# EAGLE design lm3410-sepic-rgb-led-driver-tester-mk-1 (EAGLE 6.4)
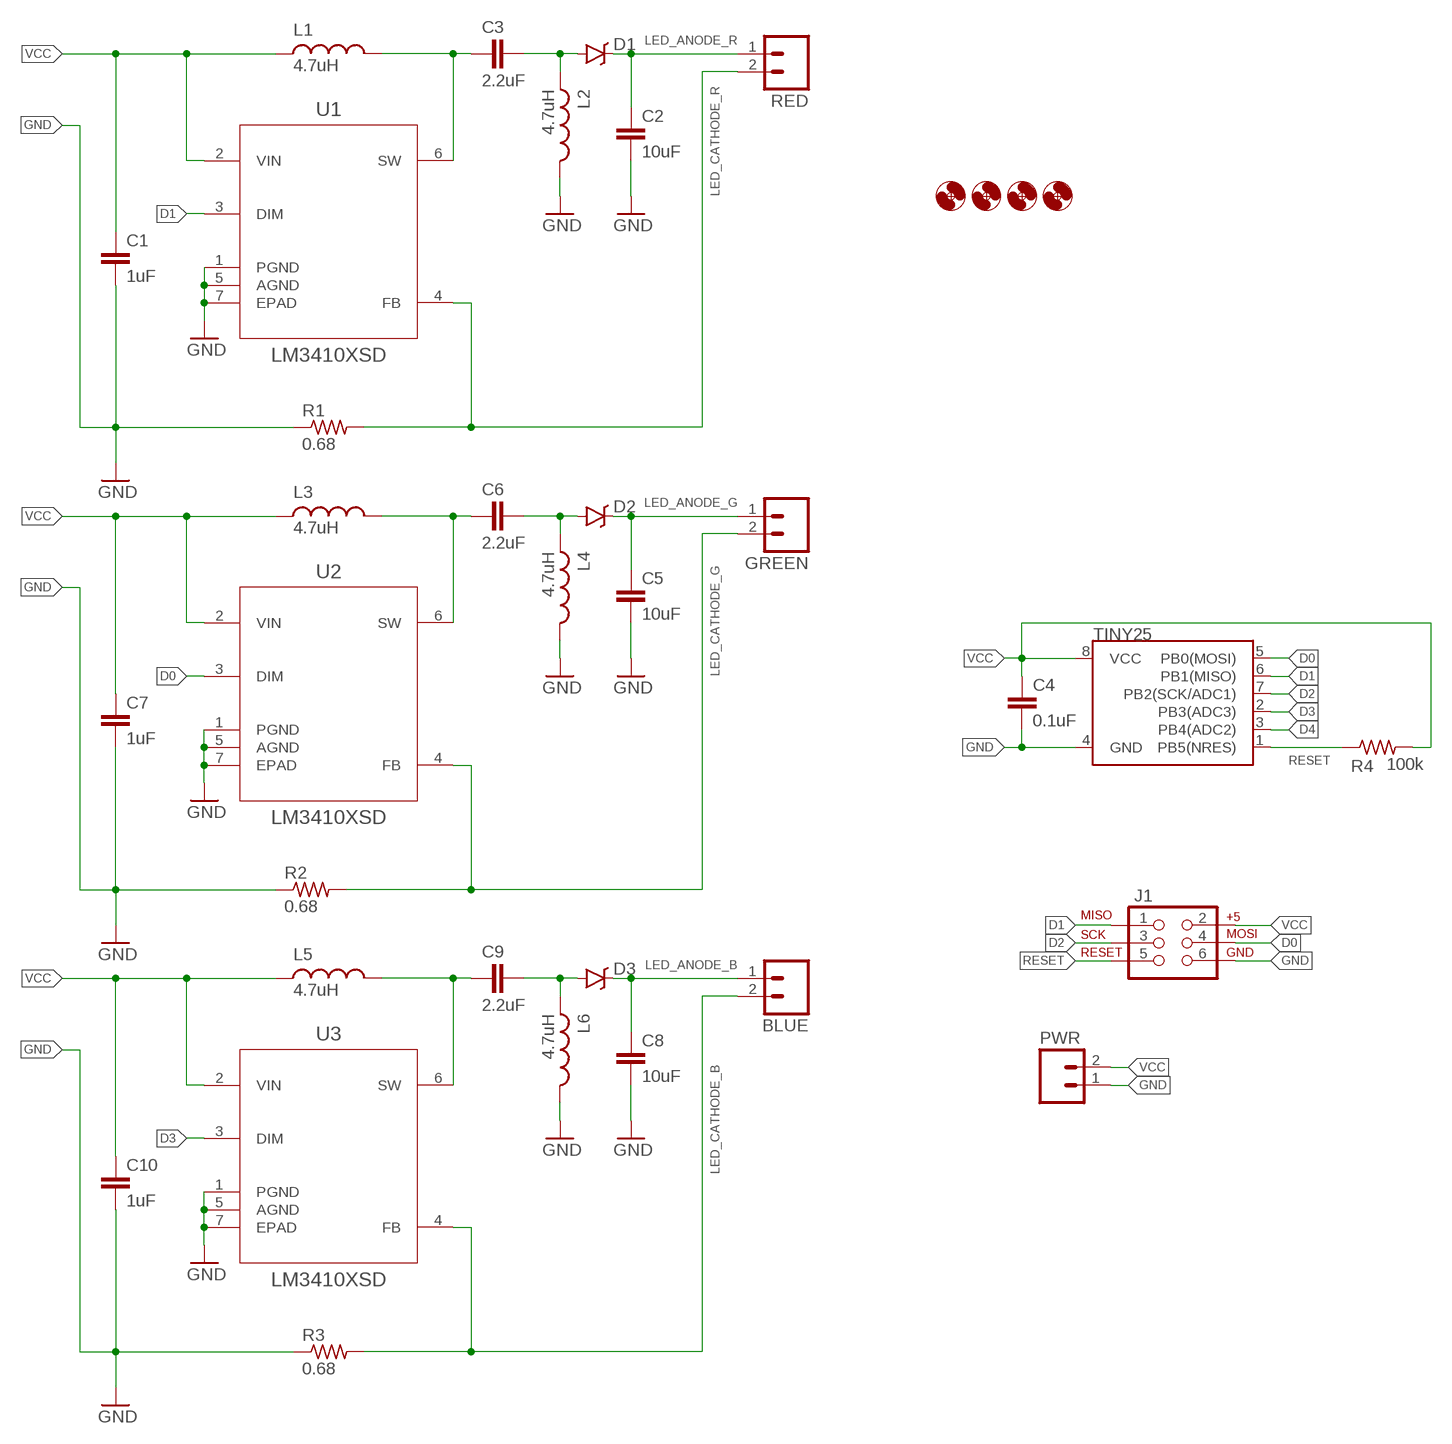
[diagram p0: schematic, sheet 1]

## Parts
BLUE  M02JST-PTH-VERT  [JST-2-PH-VERT-PTH]
C1  1uF  CAPACITOR-CERAMICC0603  [C0603]
C2  10uF  CAPACITOR-CERAMICC0603  [C0603]
C3  2.2uF  CAPACITOR-CERAMICC0805  [C0805]
C4  0.1uF  CAPACITOR-CERAMICC0603  [C0603]
C5  10uF  CAPACITOR-CERAMICC0603  [C0603]
C6  2.2uF  CAPACITOR-CERAMICC0805  [C0805]
C7  1uF  CAPACITOR-CERAMICC0603  [C0603]
C8  10uF  CAPACITOR-CERAMICC0603  [C0603]
C9  2.2uF  CAPACITOR-CERAMICC0805  [C0805]
C10  1uF  CAPACITOR-CERAMICC0603  [C0603]
D1  PMEG4005EJ  DIODE-SCHOTTKY-PMEG4005EJ  [SOD-323]
D2  PMEG4005EJ  DIODE-SCHOTTKY-PMEG4005EJ  [SOD-323]
D3  PMEG4005EJ  DIODE-SCHOTTKY-PMEG4005EJ  [SOD-323]
GREEN  M02JST-PTH-VERT  [JST-2-PH-VERT-PTH]
H1  HOLE#2  [HOLE-#2]
H2  HOLE#2  [HOLE-#2]
H3  HOLE#2  [HOLE-#2]
H4  HOLE#2  [HOLE-#2]
J1  AVR_SPI_PRG_6PTH  [2X3]
L1  4.7uH  INDUCTORIFSC-0806  [INDUCTOR_2X1.6MM]
L2  4.7uH  INDUCTORIFSC-0806  [INDUCTOR_2X1.6MM]
L3  4.7uH  INDUCTORIFSC-0806  [INDUCTOR_2X1.6MM]
L4  4.7uH  INDUCTORIFSC-0806  [INDUCTOR_2X1.6MM]
L5  4.7uH  INDUCTORIFSC-0806  [INDUCTOR_2X1.6MM]
L6  4.7uH  INDUCTORIFSC-0806  [INDUCTOR_2X1.6MM]
PWR  M02JST-PTH-VERT  [JST-2-PH-VERT-PTH]
R1  0.68  RESISTORR0805  [R0805]
R2  0.68  RESISTORR0805  [R0805]
R3  0.68  RESISTORR0805  [R0805]
R4  100k  RESISTORR0603  [R0603]
RED  M02JST-PTH-VERT  [JST-2-PH-VERT-PTH]
TINY25  ATTINY45TINY25-20-SOICN  [SO08]
U1  LM3410XSD  [DFN300X300X80-7N]
U2  LM3410XSD  [DFN300X300X80-7N]
U3  LM3410XSD  [DFN300X300X80-7N]

## Nets
D0: J1.4 TINY25.5(PB0(MOSI)) U2.3(DIM)
D1: J1.1 TINY25.6(PB1(MISO)) U1.3(DIM)
D2: J1.3 TINY25.7(PB2(SCK/ADC1))
D3: TINY25.2(PB3(ADC3)) U3.3(DIM)
D4: TINY25.3(PB4(ADC2))
GND: C1.2 C2.2 C4.2 C5.2 C7.2 C8.2 C10.2 J1.6 L2.P$2 L4.P$2 L6.P$2 PWR.1 R1.1 R2.1 R3.1 TINY25.4(GND) U1.1(PGND) U1.5(AGND) U1.7(EPAD) U2.1(PGND) U2.5(AGND) U2.7(EPAD) U3.1(PGND) U3.5(AGND) U3.7(EPAD)
LED_ANODE_B: BLUE.1 C8.1 D3.C
LED_ANODE_G: C5.1 D2.C GREEN.1
LED_ANODE_R: C2.1 D1.C RED.1
LED_CATHODE_B: BLUE.2 R3.2 U3.4(FB)
LED_CATHODE_G: GREEN.2 R2.2 U2.4(FB)
LED_CATHODE_R: R1.2 RED.2 U1.4(FB)
N$1: C3.2 D1.A L2.P$1
N$2: C6.2 D2.A L4.P$1
N$5: C9.2 D3.A L6.P$1
RESET: J1.5 R4.1 TINY25.1(PB5(NRES))
SW: C3.1 L1.P$2 U1.6(SW)
SW1: C6.1 L3.P$2 U2.6(SW)
SW2: C9.1 L5.P$2 U3.6(SW)
VCC: C1.1 C4.1 C7.1 C10.1 J1.2 L1.P$1 L3.P$1 L5.P$1 PWR.2 R4.2 TINY25.8(VCC) U1.2(VIN) U2.2(VIN) U3.2(VIN)

## Library data of the parts
BLUE GREEN PWR RED = A_butts:M02: Standard 2-pin 0.1" header. Use with - straight break away headers ( PRT-00116) - right angle break away headers (PRT-00553) - swiss pins (PRT-00743) - machine pins (PRT-00117) - female headers (PRT-00115) Molex polarized connector foot print use with: PRT-08233 with associated crimp pins and housings. 2.54_SCREWTERM for use with PRT-10571. 3.5mm Screw Terminal footprints for PRT-08084 5mm Screw Terminal footprints for use with PRT-08433
C1-C10 = A_butts:CAPACITOR-CERAMIC: CAPACITOR, European symbol
D1-D3 = A_butts:DIODE-SCHOTTKY: Schottky diodes in SFE's production catalog BAT20J 1A 23V 0.62Vf RB751 120mA 40V 0.37Vf PMEG4005EJ 0.5A 40V 0.42Vf MBRA140 1A 40V 0.5Vf B340A 3A 40V SMA; PROD_ID: DIO-10955
H1-H4 = A_butts:HOLE: MOUNTING HOLE with drill center marker
J1 = A_butts:AVR_SPI_PRG_6: AVR ISP 6 Pin This is the reduced ISP connector for AVR programming. Common on Arduino. This footprint will take up less PCB space and can be used with a 10-pin to 6-pin adapter such as SKU: BOB-08508 **Special note about "TEST_POINT" package. The stop mask is on the top side, so if you want your programming test points to be on the bottom of your board, make sure to place this package on the bottom side of the board. This also ensure that the orientation to program from the bottom side will be correct.
L1-L6 = A_butts:INDUCTOR: Inductors Basic Inductor/Choke - 0603 and 1206. Footprints are not proven and vary greatly between part numbers. SRN6045- 33uH, 20% 1.4A SDR0403-560KL - 56uH, 10%, 500mA RMS/740mA peak
R1-R4 = A_butts:RESISTOR: RESISTOR, American symbol
TINY25 = A_butts:ATTINY45: Atmel 8-pin 2/4/8kB flash uC
U1-U3 = A_butts:LM3410XSD: Constant Current Boost and SEPIC LED Driver; MPN: LM3410XSD; OC_FARNELL: -; OC_NEWARK: 11N9218; PACKAGE: DFN-6; SUPPLIER: National Semiconductor

## Board
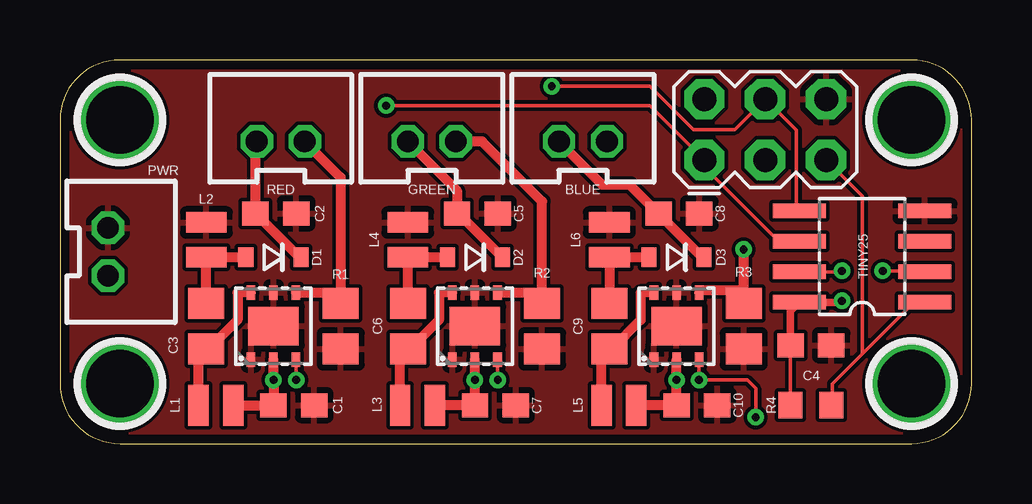
[diagram p1: board, top side]
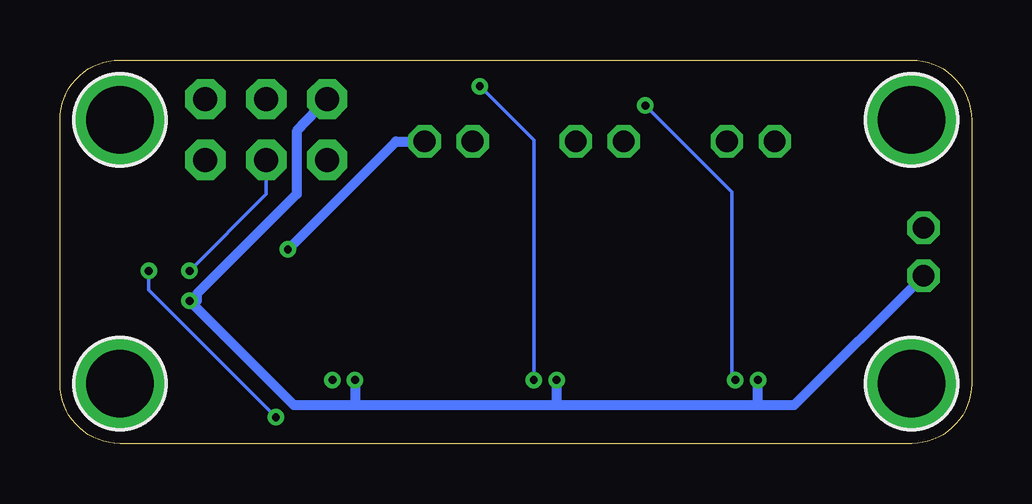
[diagram p2: board, bottom side, seen from below]

Size 38 x 16 mm. Coordinates in mm from the lower left corner, seen from the top.
Outline: 2.5,0 35.5,0 arc90 38,2.5 38,13.5 arc90 35.5,16 2.5,16 arc90 0,13.5 0,2.5 arc90 2.5,0
Copper layers (1*16): Top 0.0356mm / dielectric 1.5011mm / Bottom 0.0356mm
Design rules "LaenPCBOrder2": minimum track width 6mil, minimum drill 13mil, track to track 6mil, track to pad 6mil, pad to pad 6mil, via to via 6mil, smd to smd 6mil, copper to edge 15mil, drill to drill 6mil, minimum pad ring 7mil, minimum via ring 7mil, stop-mask expansion 3mil, vias tented up to drill 20mil, thermal gap 10mil

### Footprints (pad centres in the part's own frame; a part is rotated, then mirrored left to right if it is on the bottom)
JST-2-PH-VERT-PTH = drill 0.9 octagon: 1 -1,0; 2 1,0
C0603 = smd 1.1 x 1: 1 -0.85,0; 2 0.85,0
C0805 = smd 1.3 x 1.5: 1 -0.95,0; 2 0.95,0
SOD-323 = smd 0.63 x 0.83: A 1.15,0; C -1.15,0
HOLE-#2 = drill 2.8 pad 3.81: P$1 0,0
2X3 = drill 1 pad 1.676 octagon: 1 -2.54,-1.27; 2 -2.54,1.27; 3 0,-1.27; 4 0,1.27; 5 2.54,-1.27; 6 2.54,1.27
INDUCTOR_2X1.6MM = smd 0.85 x 1.7: P$1 -0.725,0; P$2 0.725,0
R0805 = smd 1.3 x 1.5: 1 -0.95,0; 2 0.95,0
R0603 = smd 1 x 1.1: 1 -0.85,0; 2 0.85,0
SO08 = smd 0.61 x 2.21: 1 -1.905,-2.616; 2 -0.635,-2.616; 3 0.635,-2.616; 4 1.905,-2.616; 5 1.905,2.616; 6 0.635,2.616; 7 -0.635,2.616; 8 -1.905,2.616
DFN300X300X80-7N = smd 0.61 x 0.356: 1 -1.397,0.94; 2 -1.397,0; 3 -1.397,-0.94; 4 1.397,-0.94; 5 1.397,0; 6 1.397,0.94 | smd 1.6 x 2.108: 7 0,0

### Placement (x,y rotation side)
BLUE  21.8,12.6 0 top
C1  9.75,1.6 0 top
C2  9,9.6 0 top
C3  6.1,4.9 90 top
C4  31.3,4.1 0 top
C5  17.4,9.6 0 top
C6  14.5,4.9 90 top
C7  18.15,1.6 0 top
C8  25.8,9.6 0 top
C9  22.9,4.9 90 top
C10  26.55,1.6 0 top
D1  8.9,7.77 180 top
D2  17.3,7.77 180 top
D3  25.7,7.77 180 top
GREEN  15.5,12.6 0 top
H1  2.5,2.5 0 top
H2  2.5,13.5 0 top
H3  35.5,13.5 0 top
H4  35.5,2.5 0 top
J1  29.4,13.1 0 top
L1  6.5,1.6 180 top
L2  6.1,8.5 90 top
L3  14.9,1.6 180 top
L4  14.5,8.5 90 top
L5  23.3,1.6 180 top
L6  22.9,8.5 90 top
PWR  2,8 270 top
R1  11.7,4.9 90 top
R2  20.1,4.9 90 top
R3  28.5,4.9 90 top
R4  31.3,1.6 180 top
RED  9.2,12.6 0 top
TINY25  33.44,7.8 90 top
U1  8.9,4.9 90 top
U2  17.3,4.9 90 top
U3  25.7,4.9 90 top

### Tracks (layer width: path | path; a pad name or v marks a point on that pad's centre or on a via)
D0  (via drill 0.33)
  Top 0.152: TINY25.5 30.7,9.83 30.7,13.07 J1.4 28.13,13.1 26.4,13.1 24.6,14.9 v20.5,14.9 | U2.3 v18.24,2.66 v18.25,2.65
  Bottom 0.152: v18.25,2.65 18.25,12.65 v20.5,14.9
D1  (via drill 0.33)
  Top 0.152: TINY25.6 29.96,8.44 26.86,11.54 J1.1 24.59,14.1 v13.6,14.1 | U1.3 v9.85,2.65
  Bottom 0.152: v13.6,14.1 10,10.5 10,2.8 v9.85,2.65
D2  (via drill 0.33)
  Top 0.152: TINY25.7 32.56,7.17 v32.6,7.2
  Bottom 0.152: J1.3 29.4,10.4 v32.6,7.2
D3  (via drill 0.33)
  Top 0.152: U3.3 v26.64,2.65 | v26.64,2.65 | TINY25.2 36.02,7.2 v34.3,7.2 | v26.64,2.65 28.65,2.65 29,2.3 v29,1.1
  Bottom 0.152: v34.3,7.2 34.3,6.4 v29,1.1
GND
  pour Top (rank 6): 0,2.5 0,13.5 arc-90 2.5,16 35.5,16 arc-90 38,13.5 38,2.5 arc-90 35.5,0 2.5,0 arc-90
LED_ANODE_B
  Top 0.406: BLUE.1 22.6,10.8 23.8,10.8 23.8,10.75 C8.1 26.78,7.77 D3.C
LED_ANODE_G
  Top 0.406: GREEN.1 16.55,10.55 C5.1 16.62,9.6 D2.C
LED_ANODE_R
  Top 0.406: D1.C 9.98,7.77 C2.1 8.15,12.55 RED.1
LED_CATHODE_B  (via drill 0.33)
  Top 0.406: R3.2 28.5,6.4 | 28.5,6.4 v28.5,8.1 | U3.4 26.74,6.4 28.5,6.4
  Bottom 0.406: v28.5,8.1 24,12.6 BLUE.2
LED_CATHODE_G
  Top 0.406: R2.2 20.1,6.4 | 20.1,6.4 20.1,10.1 17.6,12.6 GREEN.2 | U2.4 20,6.3 20.1,6.4
LED_CATHODE_R
  Top 0.406: RED.2 11.7,11.1 11.7,6.3 | 11.7,6.3 R1.2 | U1.4 11.7,6.3
N$1
  Top 0.406: C3.2 L2.P$1 D1.A
N$2
  Top 0.406: C6.2 L4.P$1 D2.A
N$5
  Top 0.406: C9.2 L6.P$1 D3.A
RESET
  Top 0.152: TINY25.1 35.59,5.89 33.45,3.75 | 33.45,3.75 32.2,2.5 32.2,1.65 R4.1 | J1.5 33.45,10.32 33.45,3.75
SW
  Top 0.406: L1.P$2 5.78,3.95 C3.1 6.2,3.95 7.4,5.15 7.4,6.3 U1.6
SW1
  Top 0.406: L3.P$2 14.18,3.95 C6.1 | U2.6 15.8,6.3 15.8,5.15 14.6,3.95 C6.1 | 14.8,4.1 14.65,4.1 C6.1
SW2
  Top 0.406: L5.P$2 22.57,3.95 C9.1 23,3.95 24.2,5.15 24.2,6.3 U3.6
VCC  (via drill 0.33)
  Top 0.152: C4.1 R4.2
  Top 0.305: v32.6,5.95 32.55,5.89 TINY25.8 30.45,5.52 C4.1
  Top 0.406: U3.2 v25.7,2.65 C10.1 L5.P$1 | L3.P$1 C7.1 v17.3,2.65 U2.2 | U1.2 v8.9,2.65 C1.1 L1.P$1
  Bottom 0.406: C1.1 C7.1 | C7.1 C10.1 | C1.1 v8.9,2.65 | v17.3,2.65 C7.1 | v25.7,2.65 C10.1 | J1.2 28.13,13.03 28.13,10.4 32.3,6.23 32.3,5.95 v32.6,5.95 28.25,1.6 C10.1 | PWR.2 7.4,1.6 C1.1